# Altium schematic sheet power_management.SchDoc
size Letter; SheetNumber: 5; SheetTotal: 8
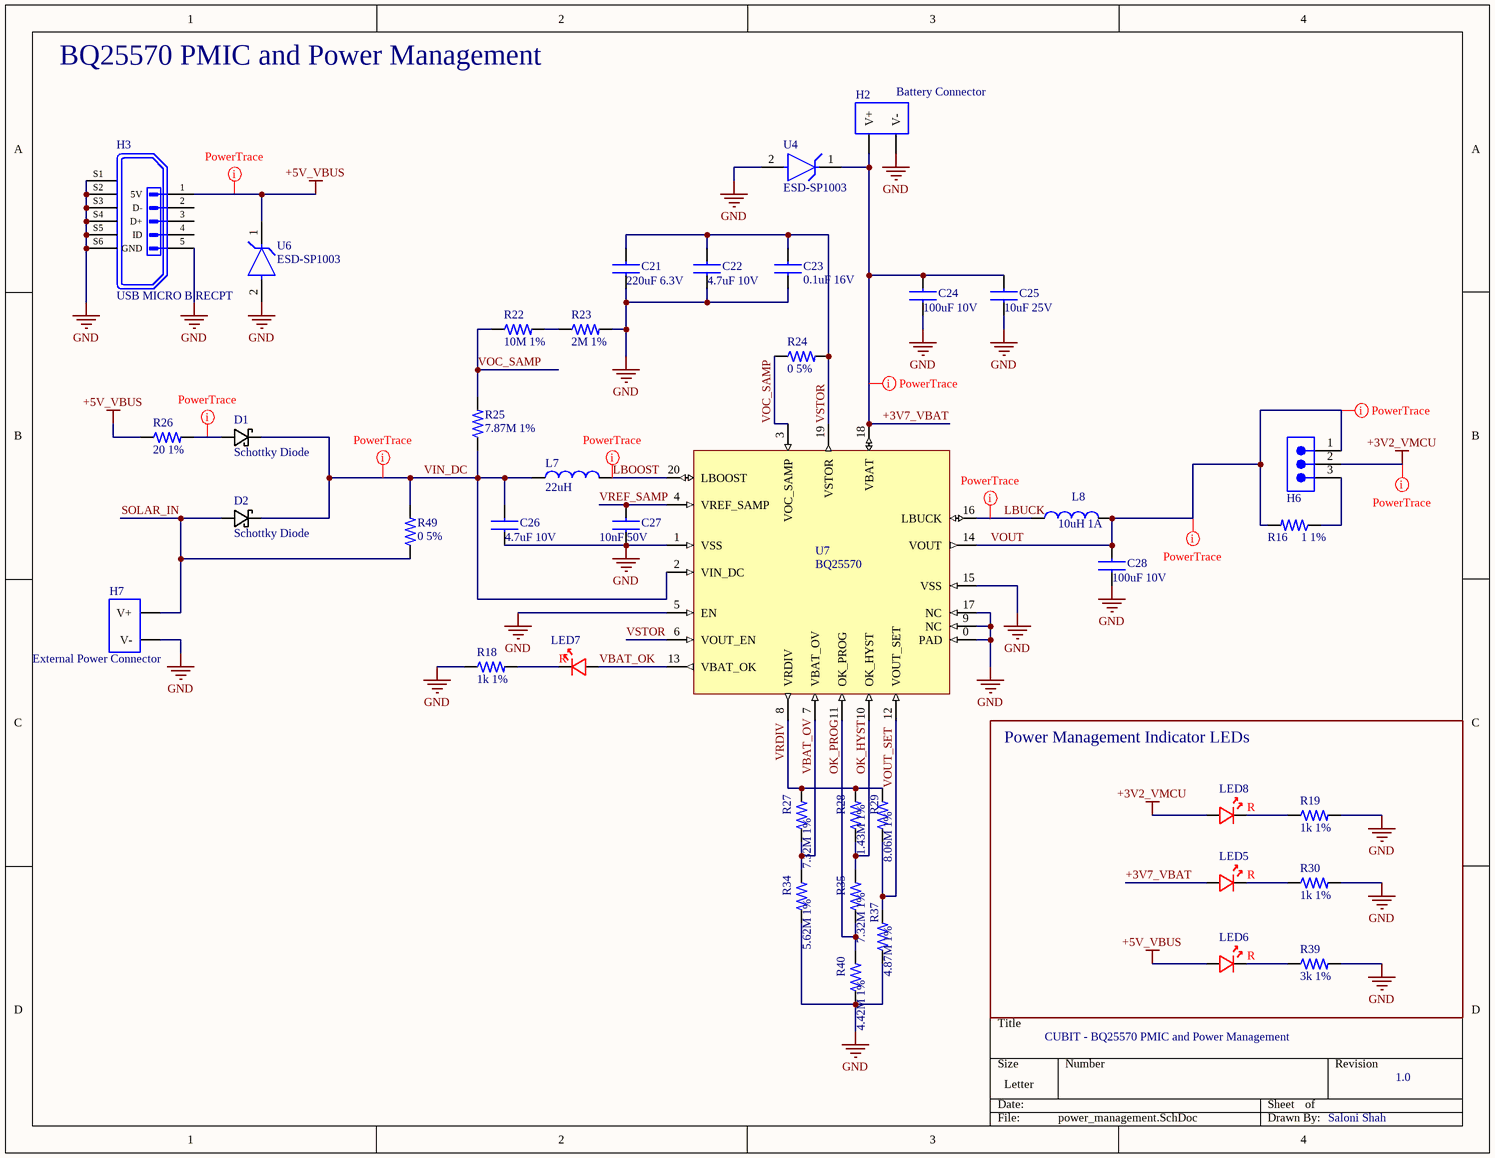
[diagram p0: power_management.SchDoc]

## Parts
C21  220uF 6.3V  [Chip_1210_3.2x2.5]
C22  4.7uF 10V  [CAP_0603_1MM]
C23  0.1uF 16V  [CAP_0603_1MM]
C24  100uF 10V  [Chip_1210_3.2x2.5]
C25  10uF 25V  [CAP_0805_02X125]
C26  4.7uF 10V  [CAP_0603_1MM]
C27  10nF 50V  [CAP_0805_02X125]
C28  100uF 10V  [Chip_1210_3.2x2.5]
D1  Schottky Diode  [SCHOTTKY4336X33N]
D2  Schottky Diode  [SCHOTTKY4336X33N]
H2  Battery Connector  [BAT_CONN]
H3  USB MICRO B RECPT  [MICROUSB_AMPHENOL_10118194-0001LF]
H6  PREC003SAAN-RC  [3_PIN_100mil]  (value not drawn)
H7  External Power Connector  [2_PIN_100mil]
L7  22uH  [2_IND_3x3]
L8  10uH 1A  [2_chip_2.5x2]
LED5  150060RS75000  [LED_0603_RED_WL-SMCW]  (value not drawn)
LED6  150060RS75000  [LED_0603_RED_WL-SMCW]  (value not drawn)
LED7  150060RS75000  [LED_0603_RED_WL-SMCW]  (value not drawn)
LED8  150060RS75000  [LED_0603_RED_WL-SMCW]  (value not drawn)
R16  1 1%  [CAP_0603_1MM]
R18  1k 1%  [2_Chip_0603_RMCF]
R19  1k 1%  [2_Chip_0603_RMCF]
R22  10M 1%  [2_Chip_0603_RMCF]
R23  2M 1%  [2_Chip_0603_RMCF]
R24  0 5%  [CAP_0402_1mm]
R25  7.87M 1%  [2_Chip_0603_RMCF]
R26  20 1%  [2_Chip_0603_RMCF]
R27  7.32M 1%  [2_Chip_0603_RMCF]
R28  1.43M 1%  [2_Chip_0603_RMCF]
R29  8.06M 1%  [2_Chip_0603_RMCF]
R30  1k 1%  [2_Chip_0603_RMCF]
R34  5.62M 1%  [2_Chip_0603_RMCF]
R35  7.32M 1%  [2_Chip_0603_RMCF]
R37  4.87M 1%  [2_Chip_0603_RMCF]
R39  3k 1%  [CAP_0603_1MM]
R40  4.42M 1%  [2_Chip_0603_RMCF]
R49  0 5%  [CAP_0402_1mm]
U4  ESD-SP1003  [Littelfuse_Inc_SP1003_MFG]
U6  ESD-SP1003  [Littelfuse_Inc_SP1003_MFG]
U7  BQ25570  [21_QFN_35x35]

## Blocks framed on the sheet
Power Management Indicator LEDs: LED5 LED6 LED8 R19 R30 R39

## Nets
+3V2_VMCU: H6.2 LED8.A
+5V_VBUS: H3.1(5V) LED6.A R26.1 U6.1(C)
GND: C21.2 C22.2 C23.2 C24.2 C25.2 C26.2 C27.2 C28.2 H2.V- H3.5(GND) H3.S1 H3.S2 H3.S3 H3.S4 H3.S5 H3.S6 H7.2(V-) R18.1 R19.2 R23.2 R30.2 R34.1 R37.1 R39.2 R40.1 U4.2(A) U6.2(A) U7.0(PAD) U7.1(VSS) U7.5(EN) U7.9(NC) U7.15(VSS) U7.17(NC)
+3V7_VBAT: C24.1 C25.1 H2.V+ LED5.A U4.1(C) U7.18(VBAT)
LBOOST: L7.2 U7.20(LBOOST)
LBUCK: L8.1 U7.16(LBUCK)
OK_HYST: R28.1 R35.2 U7.10(OK_HYST)
OK_PROG: R35.1 R40.2 U7.11(OK_PROG)
SOLAR_IN: D2.A H7.1(V+) R49.1
VBAT_OK: LED7.A U7.13(VBAT_OK)
VBAT_OV: R27.1 R34.2 U7.7(VBAT_OV)
VIN_DC: C26.1 D1.C D2.C L7.1 R25.1 R49.2 U7.2(VIN_DC)
VOC_SAMP: R22.1 R24.1 R25.2 U7.3(VOC_SAMP)
VOUT: C28.1 H6.1 L8.2 R16.2 U7.14(VOUT)
VOUT_SET: R29.1 R37.2 U7.12(VOUT_SET)
VRDIV: R27.2 R28.2 R29.2 U7.8(VRDIV)
VREF_SAMP: C27.1 U7.4(VREF_SAMP)
VSTOR: C21.1 C22.1 C23.1 R24.2 U7.6(VOUT_EN) U7.19(VSTOR)
NetD1_A: D1.A R26.2
NetH6_3: H6.3 R16.1
NetLED5_C: LED5.C R30.1
NetLED6_C: LED6.C R39.1
NetLED7_C: LED7.C R18.2
NetLED8_C: LED8.C R19.1
NetR22_2: R22.2 R23.1

Not connected (* = marked no-connect by the designer): H3 2(D-) 3(D+) 4(ID)

## Layout directives
rule Width Constraint [Pref Width = 20mil    Min Width = 6mil    Max Width = 100mil]: +3V2_VMCU, +3V7_VBAT, +5V_VBUS, LBOOST, LBUCK, NetD1_A, VIN_DC, VOUT

## Notes on the sheet
- BQ25570 PMIC and Power Management
- CUBIT - BQ25570 PMIC and Power Management
- 1.0
- Saloni Shah
- (in symbol 150060RS75000) R

## Library data of the parts
C21 = GRM32ER60J227ME05L: Cap 220uF 6.3volts X5R 20%; Manufacturer: Murata; Supplier 1: Digi-Key; Manufacturer Part Number: GRM32ER60J227ME05L; RoHS: Yes; Category: Ceramic Capacitors; Stock 1: 877; Pricing 1: 1=1.62000, 10=1.27900, 50=1.10820, 100=0.95910, 500=0.72462 (USD); Voltage Rating (DC): 6.3V; Dielectric: X5R; Tolerance: 20%; Capacitance: 220uF; Length: 3.2mm; Width: 2.5mm; Thickness: 2.5mm; RoHS Compliant: Yes; ComponentLink1URL: http://www.farnell.com/datasheets/2867883.pdf?src-supplier=Farnell; ComponentLink1Description: http://www.farnell.com/datasheets/2867883.pdf?src-supplier=Farnell; ComponentLink2URL: http://www.farnell.com/datasheets/2867883.pdf?src-supplier=Newark; ComponentLink2Description: http://www.farnell.com/datasheets/2867883.pdf?src-supplier=Newark; ComponentLink3URL: http://search.murata.co.jp/Ceramy/image/img/A01X/G101/ENG/GRM32ER60J227ME05-01.pdf?src-supplier=Digi-Key; ComponentLink3Description: http://search.murata.co.jp/Ceramy/image/img/A01X/G101/ENG/GRM32ER60J227ME05-01.pdf?src-supplier=Digi-Key; ComponentLink4URL: https://search.murata.co.jp/Ceramy/image/img/A01X/G101/ENG/GRM32ER60J227ME05-01.pdf?src-supplier=Digi-Key; ComponentLink4Description: https://search.murata.co.jp/Ceramy/image/img/A01X/G101/ENG/GRM32ER60J227ME05-01.pdf?src-supplier=Digi-Key
C22 C26 = CL10A475KP8NNNC: Cap CL10 Series 4.7 uF 10 V ±10 % Tolerance X5R SMT Multilayer Ceramic Capacitor; Manufacturer: Samsung; Tolerance: 10%; Supplier 1: Digi-Key; Manufacturer Part Number: CL10A475KP8NNNC; RoHS: Yes; Category: Ceramic Capacitors; Stock 1: 5517923; Pricing 1: 1=0.10000, 10=0.04700, 50=0.02580, 100=0.02110, 500=0.01506, 1000=0.01183 (USD); Mount: Surface Mount; Case/Package: 0603; Case Code (Metric): 1608; Case Code (Imperial): 0603; Contact Plating: Tin; Min Operating Temperature: -55°C; Max Operating Temperature: 85°C; Capacitance: 4.7uF; Dielectric: X5R; Package Quantity: 1; Packaging: Tape and Reel; Voltage Rating: 10V; Series: CL; Construction: Flat; Length: 1.6mm; Width: 0.031inch; Height: 0.8mm; Thickness: 0.035inch; Depth: 0.8mm; Radiation Hardening: No; RoHS Compliant: Yes; ComponentLink1URL: https://datasheet.ciiva.com/25797/cl10a475kp8nnnc-25797520.pdf?src-supplier=Digi-Key; ComponentLink1Description: https://datasheet.ciiva.com/25797/cl10a475kp8nnnc-25797520.pdf?src-supplier=Digi-Key; ComponentLink2URL: https://datasheet.ciiva.com/26838/getdatasheetpartid-358676-26838384.pdf?src-supplier=Verical; ComponentLink2Description: https://datasheet.ciiva.com/26838/getdatasheetpartid-358676-26838384.pdf?src-supplier=Verical; ComponentLink3URL: https://datasheet.ciiva.com/16318/cl05b104kq5nnnc-16318245.pdf?src-supplier=Future+Electronics; ComponentLink3Description: https://datasheet.ciiva.com/16318/cl05b104kq5nnnc-16318245.pdf?src-supplier=Future+Electronics
C23 = C0805C104K4RACAUTO: Cap Ceramic 0.1uF 16V X7R 10% SMD 0805 125°C Paper T/R; Manufacturer: KEMET; Capacitance: 100nF; Supplier 1: Digi-Key; Manufacturer Part Number: C0805C104K4RACAUTO; RoHS: Yes; Category: Ceramic Capacitors; Stock 1: 15900; Pricing 1: 1=0.24000, 10=0.16200, 50=0.09700, 100=0.08190, 500=0.05606, 1000=0.04959 (USD); Case/Package: 0805; Min Operating Temperature: -55°C; Max Operating Temperature: 125°C; Tolerance: 10%; Packaging: Tape and Reel; Dielectric: X7R; Length: 2mm; Depth: 1.25mm; RoHS Compliant: Yes; ComponentLink1URL: http://components.arrow.com/part/dataview/0323_00325188?src-supplier=Arrow+Europe; ComponentLink1Description: http://components.arrow.com/part/dataview/0323_00325188?src-supplier=Arrow+Europe
C24 C28 = CL32A107MPVNNNE: Cap 100uF ±20% 10V X5R 1210; Manufacturer: Samsung; Material: Ceramic; Supplier 1: Digi-Key; Manufacturer Part Number: CL32A107MPVNNNE; RoHS: Yes; Category: Ceramic Capacitors; Stock 1: 174637; Pricing 1: 1=1.14000, 10=0.86800, 50=0.72080, 100=0.62070, 500=0.48056 (USD); Mount: Surface Mount; Case/Package: 1210; Case Code (Metric): 3225; Case Code (Imperial): 1210; Contact Plating: Tin; Min Operating Temperature: -55°C; Max Operating Temperature: 85°C; Tolerance: 20%; Capacitance: 100uF; Voltage Rating: 10V; Packaging: Tape and Reel; Dielectric: X5R; Voltage: 10V; Voltage Rating (DC): 10V; Length: 3.2mm; Width: 0.098inch; Height: 2.5mm; Thickness: 0.11inch; Depth: 2.5mm; Radiation Hardening: No; Lead Free: Lead Free; RoHS Compliant: Yes; ComponentLink1URL: https://datasheet.ciiva.com/26947/getdatasheetpartid-468228-26947022.pdf?src-supplier=Verical; ComponentLink1Description: https://datasheet.ciiva.com/26947/getdatasheetpartid-468228-26947022.pdf?src-supplier=Verical
C25 = GRM21BR61E106KA73K: Cap 0805 25 V 10 uF ±20% Tolerance X5R Monolithic Ceramic Chip Capacitor; Manufacturer: Murata; Tolerance: 10%; Supplier 1: Digi-Key; Manufacturer Part Number: GRM21BR61E106KA73K; RoHS: Yes; Category: Ceramic Capacitors; Stock 1: 1875; Pricing 1: 1=0.23000, 10=0.15700, 50=0.09400, 100=0.07940, 500=0.05434, 1000=0.04807, 2500=0.04598, 5000=0.04180 (USD); Mount: Surface Mount; Case/Package: 0805; Weight: 0.000335oz; Min Operating Temperature: -55°C; Max Operating Temperature: 85°C; Packaging: Tape and Reel; Capacitance: 10uF; Voltage Rating: 25V; Package Quantity: 10000; Dielectric: X5R; Voltage Rating (DC): 25V; Length: 0.079inch; Width: 0.049inch; Thickness: 0.055inch; RoHS Compliant: Yes; ComponentLink1URL: http://www.mouser.com/ds/2/281/c02e-2905.pdf?src-supplier=Mouser; ComponentLink1Description: http://www.mouser.com/ds/2/281/c02e-2905.pdf?src-supplier=Mouser; ComponentLink2URL: http://search.murata.co.jp/Ceramy/image/img/A01X/G101/ENG/GRM21BR61E106KA73-01.pdf?src-supplier=Digi-Key; ComponentLink2Description: http://search.murata.co.jp/Ceramy/image/img/A01X/G101/ENG/GRM21BR61E106KA73-01.pdf?src-supplier=Digi-Key; ComponentLink3URL: https://search.murata.co.jp/Ceramy/image/img/A01X/G101/ENG/GRM21BR61E106KA73-01.pdf?src-supplier=Digi-Key; ComponentLink3Description: https://search.murata.co.jp/Ceramy/image/img/A01X/G101/ENG/GRM21BR61E106KA73-01.pdf?src-supplier=Digi-Key
C27 = CL21B103KBCNNNC: Cap 10nF ±10% 50V X7R 0805; Manufacturer: Samsung; Supplier 1: Digi-Key; Manufacturer Part Number: CL21B103KBCNNNC; RoHS: Yes; Category: Ceramic Capacitors; Stock 1: 358475; Pricing 1: 1=0.10000, 10=0.05000, 50=0.02700, 100=0.02210, 500=0.01578, 1000=0.01240 (USD); Mount: Surface Mount; Case/Package: 0805; Case Code (Metric): 2012; Case Code (Imperial): 0805; Contact Plating: Tin; Min Operating Temperature: -55°C; Max Operating Temperature: 125°C; Packaging: Tape and Reel; Series: CL; Voltage Rating: 50V; Capacitance: 10nF; Tolerance: 10%; Dielectric: X7R; Voltage Rating (DC): 50V; Construction: Flat; Length: 2mm; Width: 0.049inch; Height: 0.85mm; Thickness: 0.037inch; Depth: 1.25mm; Radiation Hardening: No; RoHS Compliant: Yes; Lead Free: Lead Free; ComponentLink1URL: https://datasheet.ciiva.com/26920/getdatasheetpartid-640087-26920198.pdf?src-supplier=Verical; ComponentLink1Description: https://datasheet.ciiva.com/26920/getdatasheetpartid-640087-26920198.pdf?src-supplier=Verical; ComponentLink2URL: https://datasheet.ciiva.com/26787/cl21b103kbcnnnc-26787008.pdf?src-supplier=IIIC; ComponentLink2Description: https://datasheet.ciiva.com/26787/cl21b103kbcnnnc-26787008.pdf?src-supplier=IIIC
D1 D2 = LSM115JE3/TR13: LSM115J Series 15 V 1 A Surface Mount Schottky Rectifier - DO-214BA; Manufacturer: Microchip; Supplier 1: Digi-Key; Manufacturer Part Number: LSM115JE3/TR13; RoHS: Yes; Stock 1: 16365; Pricing 1: 1=0.51000 (USD)
H2 = 0554600272: 2.00mm Pitch Mi ll System Wire-to-Board Header, Surface Mount, Single Row, Vertical, 2 Circuits; Manufacturer: Molex; Number of Positions: 2; Connector Type: Male Pin; Max Voltage Rating (AC): 125V; Pitch: 0.079inch; Supplier 1: Digi-Key; Manufacturer Part Number: 0554600272; RoHS: Yes; Category: Headers and Wire Housings; Stock 1: 5247; Pricing 1: 1=1.33000, 10=1.10500, 100=0.92040 (USD); Mount: Surface Mount; Housing Material: Polyamide; Contact Plating: Tin,Copper; Contact Material: Bronze; Color: Natural; Housing Color: Natural; Min Operating Temperature: -40°C; Max Operating Temperature: 105°C; Number of Rows: 1; Packaging: Tape and Reel; Termination: Solder; Orientation: Straight; Length: 8.1mm; Depth: 7mm; RoHS Compliant: Yes; ComponentLink1URL: https://datasheet.ciiva.com/18487/554600272-sd-18487017.pdf?src-supplier=Digi-Key; ComponentLink1Description: https://datasheet.ciiva.com/18487/554600272-sd-18487017.pdf?src-supplier=Digi-Key; ComponentLink2URL: https://datasheet.ciiva.com/18487/554600272-sd-18487018.pdf?src-supplier=Digi-Key; ComponentLink2Description: https://datasheet.ciiva.com/18487/554600272-sd-18487018.pdf?src-supplier=Digi-Key; ComponentLink3URL: https://datasheet.ciiva.com/18487/554600272-sd-18487019.pdf?src-supplier=Digi-Key; ComponentLink3Description: https://datasheet.ciiva.com/18487/554600272-sd-18487019.pdf?src-supplier=Digi-Key
H3 = 10118194-0001LF: USB - micro B USB 2.0 Receptacle Connector 5 Position Surface Mount, Right Angle; Through Hole; Manufacturer: Amphenol FCI; Number of Terminals/Pins: 5; Current Rating: 1.8A; Connector Type: USB,Receptacle; Insulation Resistance: 1GR; Number of Ports: 1; Max Voltage Rating (AC): 100V; Pitch: 0.65mm; Supplier 1: Digi-Key; Manufacturer Part Number: 10118194-0001LF; RoHS: Yes; Category: USB Connectors; Stock 1: 87961; Pricing 1: 1=0.48000, 10=0.45100, 25=0.38680, 50=0.32860, 100=0.31580, 250=0.28360, 500=0.27070 (USD); Mount: Surface Mount,Horizontal; Contact Material: Copper Alloy; Contact Plating: Gold; Housing Material: Polymer; Color: Black; Min Operating Temperature: -55°C; Max Operating Temperature: 85°C; Package Quantity: 9600; Packaging: Tape and Reel; Gender: Receptacle; Number of Contacts: 5; Termination: Solder; Orientation: Right Angle; Features: Shielded; Length: 8.05mm; Depth: 5mm; Radiation Hardening: No; Lead Free: Lead Free; Flammability Rating: UL94 V-0; ComponentLink1URL: https://datasheet.ciiva.com/4598/10118194ac-197217-4598807.pdf?src-supplier=Mouser; ComponentLink1Description: https://datasheet.ciiva.com/4598/10118194ac-197217-4598807.pdf?src-supplier=Mouser; ComponentLink2URL: https://datasheet.ciiva.com/26945/getdatasheetpartid-418619-26945695.pdf?src-supplier=Verical; ComponentLink2Description: https://datasheet.ciiva.com/26945/getdatasheetpartid-418619-26945695.pdf?src-supplier=Verical; ComponentLink3URL: https://datasheet.ciiva.com/851/10118194-851110.pdf?src-supplier=Digi-Key; ComponentLink3Description: https://datasheet.ciiva.com/851/10118194-851110.pdf?src-supplier=Digi-Key; ComponentLink4URL: https://datasheet.ciiva.com/851/10118194-851111.pdf?src-supplier=Digi-Key; ComponentLink4Description: https://datasheet.ciiva.com/851/10118194-851111.pdf?src-supplier=Digi-Key; Supplier Part Number 1: 609-4618-6-ND
H6 = SW_3Pin_100mil_Switch: Connector Header Through Hole 3 position 0.100" (2.54mm); Value: CONN HEADER VERT 3POS 2.54MM; Digikey Link: https://www.digikey.com/product-detail/en/PREC003SAAN-RC/S1012EC-03-ND/2774851/?itemSeq=304982371; Digikey Part: S1012EC-03-ND; Type: Extended; LCSC Part#: C429954
H7 = ext_pwr_conn
L7 = VLS3015CX-220M-1: Inductor Power Shielded Wirewound 22uH 20% 1MHz Ferrite 0.87A 0.496Ohm DCR 1212 T/R; Manufacturer: TDK; Supplier 1: Digi-Key; Manufacturer Part Number: VLS3015CX-220M-1; RoHS: Yes; Category: Fixed Inductors; Stock 1: 1791; Pricing 1: 1=0.40000, 10=0.35400, 25=0.30960, 50=0.26540, 100=0.24320, 250=0.22112, 500=0.20784, 1000=0.15919 (USD); RoHS Compliant: Yes
L8 = 1239AS-H-100M=P2: Inductor Power Shielded Multi-Layer 10uH 20% 1MHz Metal 0.85A 0.46Ohm DCR 1008 T/R; Manufacturer: Murata; Core Material: Ferrite,Metal; DC Resistance (DCR): 460mR; Max DC Current: 850mA; Supplier 1: Digi-Key; Manufacturer Part Number: 1239AS-H-100M=P2; RoHS: Yes; Category: Fixed Inductors; Stock 1: 142733; Pricing 1: 1=0.39000, 10=0.34400, 25=0.30120, 50=0.25840, 100=0.23680, 250=0.21524, 500=0.20234, 1000=0.15498 (USD); Mount: Surface Mount; Case/Package: 1008; Case Code (Metric): 2520; Case Code (Imperial): 1008; Min Operating Temperature: -40°C; Max Operating Temperature: 85°C; Packaging: Tape and Reel; Resistor Type: Wirewound; Inductance: 10uH; Current Rating: 1A; Shielding: Shielded; Test Frequency: 1MHz; Tolerance: 20%; Length: 0.098inch; Width: 0.079inch; Height - Seated (Max): 0.047inch; Depth: 2mm; RoHS Compliant: Yes; ComponentLink1URL: http://www.farnell.com/datasheets/2339712.pdf?src-supplier=Farnell; ComponentLink1Description: http://www.farnell.com/datasheets/2339712.pdf?src-supplier=Farnell; ComponentLink2URL: http://www.toko.co.jp/products/pdf/inductors/dfe252012c.pdf?src-supplier=Avnet; ComponentLink2Description: http://www.toko.co.jp/products/pdf/inductors/dfe252012c.pdf?src-supplier=Avnet; ComponentLink3URL: http://www.farnell.com/datasheets/2339712.pdf?src-supplier=Newark; ComponentLink3Description: http://www.farnell.com/datasheets/2339712.pdf?src-supplier=Newark; ComponentLink4URL: https://www.murata.com/~/media/webrenewal/products/inductor/chip/tokoproducts/wirewoundmetalalloychiptype/m_dfe252012c.ashx?src-supplier=Digi-Key; ComponentLink4Description: https://www.murata.com/~/media/webrenewal/products/inductor/chip/tokoproducts/wirewoundmetalalloychiptype/m_dfe252012c.ashx?src-supplier=Digi-Key
LED5-LED8 = 150060RS75000: LED Low-Power Uni-Color Red 630nm 2V 2-Pin Chip 0603(1608Metric) T/R; Manufacturer: Wurth Electronics; Viewing Angle: 140°; Lens Style: Clear,Rectangular; Luminous Intensity: 250mcd; Forward Current: 30mA; Wavelength: 625nm; Test Current: 20mA; Supplier 1: Digi-Key; Manufacturer Part Number: 150060RS75000; RoHS: Yes; Category: LEDs; Stock 1: 39; Pricing 1: 1=0.15000, 50=0.13800, 100=0.11800, 500=0.10200, 1000=0.09900 (USD); Mount: Surface Mount; Case/Package: 0603; Color: Red; Case Code (Metric): 1608; Case Code (Imperial): 0603; Min Operating Temperature: -40°C; Max Operating Temperature: 85°C; Package Quantity: 1; Packaging: Cut Tape; Forward Voltage: 2V; Dominant Wavelength: 625nm; Length: 1.6mm; Width: 0.8mm; Height: 0.7mm; REACH SVHC: Unknown; RoHS Compliant: Yes; ComponentLink1URL: https://datasheet.ciiva.com/29563/150060rs75000-29563040.pdf?src-supplier=Digi-Key; ComponentLink1Description: https://datasheet.ciiva.com/29563/150060rs75000-29563040.pdf?src-supplier=Digi-Key; ComponentLink2URL: https://datasheet.ciiva.com/29279/759428-da-01-en-chipled-0603-w-kl-rot-150060rs75000-29279196.pdf?src-supplier=Conrad; ComponentLink2Description: https://datasheet.ciiva.com/29279/759428-da-01-en-chipled-0603-w-kl-rot-150060rs75000-29279196.pdf?src-supplier=Conrad
R16 = RC0603FR-101RL: Res 1 Ohm 1% 1/10W ±200ppm/°C Molded SMD SMD Paper T/R; Manufacturer: Yageo; Resistance: 1R; Power Rating: 100mW; Voltage Rating: 50V; Supplier 1: Digi-Key; Manufacturer Part Number: RC0603FR-101RL; Category: Chip SMD Resistors; Stock 1: 19075; Pricing 1: 1=0.10000, 10=0.04800, 100=0.01940, 1000=0.00872, 2500=0.00756, 5000=0.00625 (USD); Case/Package: 0603; Case Code (Imperial): 0603; Case Code (Metric): 1608; Contact Plating: Tin; Min Operating Temperature: -55°C; Max Operating Temperature: 155°C; Tolerance: 1%; Packaging: Tape and Reel; Resistor Type: Thick Film; Termination: SMD/SMT; Temperature Coefficient: 200ppm/°C; Series: RC; Construction: Rectangular; Length: 1.6mm; Width: 0.8mm; Height: 0.45mm; Depth: 0.8mm; Radiation Hardening: No; Military Standard: Not; RoHS Compliant: Yes; ComponentLink1URL: http://www.mouser.com/ds/2/447/RC0603-272842.pdf?src-supplier=Mouser; ComponentLink1Description: http://www.mouser.com/ds/2/447/RC0603-272842.pdf?src-supplier=Mouser; ComponentLink2URL: http://components.arrow.com/part/dataview/0323_03914755?src-supplier=Arrow+Europe; ComponentLink2Description: http://components.arrow.com/part/dataview/0323_03914755?src-supplier=Arrow+Europe; ComponentLink3URL: http://www.yageo.com/documents/recent/PYu-RC_Group_51_RoHS_L_2.pdf?src-supplier=Avnet; ComponentLink3Description: http://www.yageo.com/documents/recent/PYu-RC_Group_51_RoHS_L_2.pdf?src-supplier=Avnet; ComponentLink4URL: http://www.yageo.com/documents/recent/PYu-RC0603_51_RoHS_L_5.pdf?src-supplier=Avnet+Europe; ComponentLink4Description: http://www.yageo.com/documents/recent/PYu-RC0603_51_RoHS_L_5.pdf?src-supplier=Avnet+Europe; ComponentLink5URL: https://datasheet.octopart.com/RC0603FR-101RL-Yageo-datasheet-8328172.pdf?src-supplier=_legacy+Avnet; ComponentLink5Description: https://datasheet.octopart.com/RC0603FR-101RL-Yageo-datasheet-8328172.pdf?src-supplier=_legacy+Avnet; ComponentLink6URL: https://datasheet.octopart.com/RC0603FR-101RL-Yageo-datasheet-73766026.pdf; ComponentLink6Description: https://datasheet.octopart.com/RC0603FR-101RL-Yageo-datasheet-73766026.pdf
R18 R19 R30 = RMCF0603FT1K00: Res 1K Ohm 1% 0.1W(1/10W) ±100ppm/C Pad SMD Automotive T/R; Manufacturer: Stackpole Electronics; Resistance: 1kR; Power Rating: 100mW; Temperature Coefficient: 100ppm/°C; Supplier 1: Digi-Key; Manufacturer Part Number: RMCF0603FT1K00; RoHS: Yes; Category: Chip SMD Resistors; Pricing 1: 1=0.10000, 10=0.01700, 100=0.00680, 1000=0.00305, 2500=0.00264 (USD); Mount: Surface Mount; Case/Package: 0603; Case Code (Metric): 1608; Case Code (Imperial): 0603; Contact Plating: Tin,Matte; Size Code: 0603; Min Operating Temperature: -55°C; Max Operating Temperature: 155°C; Tolerance: 1%; Packaging: Tape and Reel; Resistor Type: Thick Film; Number of Terminations: 2; Max Power Dissipation: 100mW; Features: Automotive AEC-Q200; Series: RMCF; Construction: Rectangular; Length: 1.55mm; Width: 0.031inch; Height: 0.022inch; Depth: 0.8mm; Radiation Hardening: No; Military Standard: Not; Lead Free: Lead Free; RoHS Compliant: Yes; ComponentLink1URL: https://www.seielect.com/catalog/sei-rmcf_rmcp.pdf?src-supplier=Digi-Key; ComponentLink1Description: https://www.seielect.com/catalog/sei-rmcf_rmcp.pdf?src-supplier=Digi-Key; ComponentLink2URL: https://www.seielect.com/catalog/SEI-RMCF_RMCP.pdf?src-supplier=Avnet; ComponentLink2Description: https://www.seielect.com/catalog/SEI-RMCF_RMCP.pdf?src-supplier=Avnet; ComponentLink3URL: https://www.seielect.com/catalog/SEI-Packaging.pdf?src-supplier=Avnet; ComponentLink3Description: https://www.seielect.com/catalog/SEI-Packaging.pdf?src-supplier=Avnet; ComponentLink4URL: https://www.seielect.com/catalog/SEI-Packaging.pdf?src-supplier=Arrow+Electronics; ComponentLink4Description: https://www.seielect.com/catalog/SEI-Packaging.pdf?src-supplier=Arrow+Electronics; ComponentLink5URL: https://www.seielect.com/catalog/SEI-RMCF_RMCP.pdf?src-supplier=Avnet+Asia; ComponentLink5Description: https://www.seielect.com/catalog/SEI-RMCF_RMCP.pdf?src-supplier=Avnet+Asia; ComponentLink6URL: http://www.seielect.com/Catalog/SEI-rmc.pdf?src-supplier=Future+Electronics; ComponentLink6Description: http://www.seielect.com/Catalog/SEI-rmc.pdf?src-supplier=Future+Electronics; ComponentLink7URL: https://www.seielect.com/catalog/SEI-Packaging.pdf?src-supplier=Verical; ComponentLink7Description: https://www.seielect.com/catalog/SEI-Packaging.pdf?src-supplier=Verical; ComponentLink8URL: https://www.seielect.com/catalog/SEI-Packaging.pdf?src-supplier=Quest; ComponentLink8Description: https://www.seielect.com/catalog/SEI-Packaging.pdf?src-supplier=Quest
R22 = RMCF0603FT10M0: Res 10M Ohm 1% 1/10W ±200ppm/°C Molded SMD SMD Paper T/R; Manufacturer: Stackpole Electronics; Resistance: 10MR; Max Power Dissipation: 100mW; Supplier 1: Digi-Key; Manufacturer Part Number: RMCF0603FT10M0; RoHS: Yes; Category: Chip SMD Resistors; Stock 1: 127846; Pricing 1: 1=0.10000, 10=0.02500, 100=0.01020, 1000=0.00457, 2500=0.00397 (USD); Mount: Surface Mount; Case/Package: 0603; Case Code (Metric): 1608; Case Code (Imperial): 0603; Contact Plating: Tin,Matte; Min Operating Temperature: -55°C; Max Operating Temperature: 155°C; Tolerance: 1%; Packaging: Tape and Reel; Resistor Type: Thick Film; Number of Terminations: 2; Temperature Coefficient: 200ppm/°C; Features: Automotive AEC-Q200; Series: RMCF; Construction: Rectangular; Length: 0.061inch; Width: 0.031inch; Height: 0.022inch; Depth: 0.8mm; Radiation Hardening: No; Military Standard: Not; Lead Free: Lead Free; RoHS Compliant: Yes; ComponentLink1URL: http://components.arrow.com/part/dataview/47093497S7925112N1174?src-supplier=Arrow+Electronics; ComponentLink1Description: http://components.arrow.com/part/dataview/47093497S7925112N1174?src-supplier=Arrow+Electronics; ComponentLink2URL: https://www.seielect.com/catalog/SEI-RMCF_RMCP.pdf?src-supplier=Avnet; ComponentLink2Description: https://www.seielect.com/catalog/SEI-RMCF_RMCP.pdf?src-supplier=Avnet; ComponentLink3URL: https://www.verical.com/server-webapp/html/getDatasheet?partID=691637&src-supplier=Verical; ComponentLink3Description: https://www.verical.com/server-webapp/html/getDatasheet?partID=691637&src-supplier=Verical; ComponentLink4URL: https://www.seielect.com/catalog/SEI-Packaging.pdf?src-supplier=Digi-Key; ComponentLink4Description: https://www.seielect.com/catalog/SEI-Packaging.pdf?src-supplier=Digi-Key
R23 = RMCF0603FT2M00: RES 2M OHM 1% 1/10W 0603; Manufacturer: Stackpole Electronics; Resistance: 2MR; Max Power Dissipation: 100mW; Temperature Coefficient: 200ppm/°C; Supplier 1: Digi-Key; Manufacturer Part Number: RMCF0603FT2M00; RoHS: Yes; Category: Chip SMD Resistors; Stock 1: 2082; Pricing 1: 1=0.10000, 10=0.02500, 100=0.01020, 1000=0.00457, 2500=0.00397 (USD); Mount: Surface Mount; Case/Package: 0603; Case Code (Metric): 1608; Case Code (Imperial): 0603; Contact Plating: Tin,Matte; Min Operating Temperature: -55°C; Max Operating Temperature: 155°C; Packaging: Tape and Reel; Tolerance: 1%; Resistor Type: Thick Film; Number of Terminations: 2; Features: Automotive AEC-Q200; Series: RMCF; Construction: Rectangular; Length: 0.061inch; Width: 0.031inch; Height: 0.022inch; Depth: 0.8mm; Radiation Hardening: No; Military Standard: Not; RoHS Compliant: Yes; ComponentLink1URL: https://datasheet.ciiva.com/26875/getdatasheetpartid-719436-26875364.pdf?src-supplier=Verical; ComponentLink1Description: https://datasheet.ciiva.com/26875/getdatasheetpartid-719436-26875364.pdf?src-supplier=Verical
R24 R49 = RC1005J000CS: Res 0 Ohms ±5% 0.063 W 0402 Thick Film Surface Mount Chip Resistor; Manufacturer: Samsung; Resistance: 0R; Power Rating: 63mW; Temperature Coefficient: 200ppm/°C; Voltage Rating (DC): 50V; Supplier 1: Digi-Key; Manufacturer Part Number: RC1005J000CS; RoHS: Yes; Category: Chip SMD Resistors; Stock 1: 580; Pricing 1: 1=0.10000, 10=0.04200, 25=0.03040, 50=0.02300, 100=0.01700, 250=0.01296, 500=0.01036, 1000=0.00763, 5000=0.00547 (USD); Mount: Surface Mount; Case/Package: 0402; Case Code (Metric): 1005; Case Code (Imperial): 0402; Contact Plating: Tin; Size Code: 0402; Min Operating Temperature: -55°C; Max Operating Temperature: 125°C; Packaging: Tape and Reel; Tolerance: 5%; Resistor Type: Thick Film; Number of Terminations: 2; Max Power Dissipation: 63mW; Features: Moisture Resistant; Series: RC; Construction: Rectangular; Length: 1mm; Width: 0.02inch; Height: 0.016inch; Depth: 0.5mm; Radiation Hardening: No; Military Standard: Not; Lead Free: Lead Free; RoHS Compliant: Yes; ComponentLink1URL: https://datasheet.ciiva.com/15196/getdatasheetpartid-499011-15196236.pdf?src-supplier=Verical; ComponentLink1Description: https://datasheet.ciiva.com/15196/getdatasheetpartid-499011-15196236.pdf?src-supplier=Verical; ComponentLink2URL: https://datasheet.ciiva.com/16449/rcseries-16449310.pdf?src-supplier=Future+Electronics; ComponentLink2Description: https://datasheet.ciiva.com/16449/rcseries-16449310.pdf?src-supplier=Future+Electronics
R25 = RMCF0603FT7M87: Res 7.87M Ohm 1% 1/10W ±200ppm/°C Molded SMD SMD Paper T/R; Manufacturer: Stackpole Electronics; Resistance: 7.87MR; Max Power Dissipation: 100mW; Supplier 1: Digi-Key; Manufacturer Part Number: RMCF0603FT7M87; RoHS: Yes; Category: Chip SMD Resistors; Stock 1: 4289; Pricing 1: 1=0.10000, 10=0.02500, 100=0.01020, 1000=0.00457, 2500=0.00397 (USD); Mount: Surface Mount; Case/Package: 0603; Contact Plating: Tin,Matte; Min Operating Temperature: -55°C; Max Operating Temperature: 155°C; Packaging: Tape and Reel; Tolerance: 1%; Resistor Type: Thick Film; Number of Terminations: 2; Temperature Coefficient: 200ppm/°C; Features: Automotive AEC-Q200; Series: RMCF; Length: 0.061inch; Width: 0.031inch; Height: 0.022inch; Radiation Hardening: No; RoHS Compliant: Yes; ComponentLink1URL: https://www.seielect.com/Catalog/SEI-RMCF_RMCP.pdf?src-supplier=Digi-Key; ComponentLink1Description: https://www.seielect.com/Catalog/SEI-RMCF_RMCP.pdf?src-supplier=Digi-Key; ComponentLink2URL: https://www.seielect.com/catalog/SEI-RMCF_RMCP.pdf?src-supplier=Avnet; ComponentLink2Description: https://www.seielect.com/catalog/SEI-RMCF_RMCP.pdf?src-supplier=Avnet
R26 = KTR03EZPF20R0: Res High Voltage 0603 20 Ohm 1/10W 1% SMD; Manufacturer: Rohm; Resistance: 20R; Max Power Dissipation: 100mW; Temperature Coefficient: 100ppm/°C; Supplier 1: Digi-Key; Manufacturer Part Number: KTR03EZPF20R0; RoHS: Yes; Category: Chip SMD Resistors; Stock 1: 3395; Pricing 1: 1=0.17000, 10=0.14800, 100=0.05690, 1000=0.02505, 2500=0.02163 (USD); Case/Package: 0603; Case Code (Metric): 1608; Case Code (Imperial): 0603; Min Operating Temperature: -55°C; Max Operating Temperature: 155°C; Package Quantity: 5000; Packaging: Tape and Reel; Tolerance: 1%; Resistor Type: Thick Film; Number of Terminations: 2; Features: Automotive AEC-Q200; Series: KTR; Length: 0.063inch; Width: 0.031inch; Height: 0.022inch; RoHS Compliant: Yes; ComponentLink1URL: https://datasheet.ciiva.com/14932/ktr-14932075.pdf?src-supplier=Digi-Key; ComponentLink1Description: https://datasheet.ciiva.com/14932/ktr-14932075.pdf?src-supplier=Digi-Key; ComponentLink2URL: https://datasheet.ciiva.com/14925/ktr-14925734.pdf?src-supplier=Digi-Key; ComponentLink2Description: https://datasheet.ciiva.com/14925/ktr-14925734.pdf?src-supplier=Digi-Key
R27 R35 = RMCF0603FT7M32: Res 7.32M Ohm 1% 1/10W ±200ppm/°C Molded SMD SMD Paper T/R; Manufacturer: Stackpole Electronics; Resistance: 7.32MR; Supplier 1: Digi-Key; Manufacturer Part Number: RMCF0603FT7M32; RoHS: Yes; Category: Chip SMD Resistors; Stock 1: 10385; Pricing 1: 1=0.10000, 10=0.02500, 100=0.01020, 1000=0.00457, 2500=0.00397 (USD); Mount: Surface Mount; Case/Package: 0603; Contact Plating: Tin,Matte; Min Operating Temperature: -55°C; Max Operating Temperature: 155°C; Packaging: Tape and Reel; Tolerance: 1%; Resistor Type: Thick Film; Temperature Coefficient: 200ppm/°C; Radiation Hardening: No; RoHS Compliant: Yes; ComponentLink1URL: https://www.seielect.com/catalog/SEI-RMCF_RMCP.pdf?src-supplier=Avnet; ComponentLink1Description: https://www.seielect.com/catalog/SEI-RMCF_RMCP.pdf?src-supplier=Avnet; ComponentLink2URL: https://www.seielect.com/catalog/sei-rmcf_rmcp.pdf?src-supplier=Digi-Key; ComponentLink2Description: https://www.seielect.com/catalog/sei-rmcf_rmcp.pdf?src-supplier=Digi-Key
R28 = RMCF0603FT1M43: Res 1.43M Ohm 1% 1/10W ±200ppm/°C Molded SMD SMD Paper T/R; Manufacturer: Stackpole Electronics; Resistance: 1.43MR; Supplier 1: Digi-Key; Manufacturer Part Number: RMCF0603FT1M43; RoHS: Yes; Category: Chip SMD Resistors; Stock 1: 5908; Pricing 1: 1=0.10000, 10=0.02500, 100=0.01020, 1000=0.00457, 2500=0.00397 (USD); Mount: Surface Mount; Case/Package: 0603; Contact Plating: Tin,Matte; Min Operating Temperature: -55°C; Max Operating Temperature: 155°C; Packaging: Tape and Reel; Tolerance: 1%; Resistor Type: Thick Film; Temperature Coefficient: 200ppm/°C; Radiation Hardening: No; RoHS Compliant: Yes; ComponentLink1URL: http://components.arrow.com/part/dataview/40961582S8179483N1174?src-supplier=Arrow+Electronics; ComponentLink1Description: http://components.arrow.com/part/dataview/40961582S8179483N1174?src-supplier=Arrow+Electronics; ComponentLink2URL: https://www.seielect.com/catalog/sei-rmcf_rmcp.pdf?src-supplier=Digi-Key; ComponentLink2Description: https://www.seielect.com/catalog/sei-rmcf_rmcp.pdf?src-supplier=Digi-Key; ComponentLink3URL: https://www.seielect.com/catalog/SEI-RMCF_RMCP.pdf?src-supplier=Avnet; ComponentLink3Description: https://www.seielect.com/catalog/SEI-RMCF_RMCP.pdf?src-supplier=Avnet
R29 = RMCF0603FT8M06: Res 8.06M Ohm 1% 1/10W ±200ppm/°C Molded SMD SMD Paper T/R; Manufacturer: Stackpole Electronics; Resistance: 8.06MR; Supplier 1: Digi-Key; Manufacturer Part Number: RMCF0603FT8M06; RoHS: Yes; Category: Chip SMD Resistors; Stock 1: 19888; Pricing 1: 1=0.10000, 10=0.02500, 100=0.01020, 1000=0.00457, 2500=0.00397 (USD); Mount: Surface Mount; Case/Package: 0603; Contact Plating: Tin,Matte; Min Operating Temperature: -55°C; Max Operating Temperature: 155°C; Packaging: Tape and Reel; Tolerance: 1%; Resistor Type: Thick Film; Temperature Coefficient: 200ppm/°C; Radiation Hardening: No; RoHS Compliant: Yes; ComponentLink1URL: https://www.seielect.com/catalog/SEI-RMCF_RMCP.pdf?src-supplier=Avnet; ComponentLink1Description: https://www.seielect.com/catalog/SEI-RMCF_RMCP.pdf?src-supplier=Avnet; ComponentLink2URL: https://www.seielect.com/catalog/SEI-Packaging.pdf?src-supplier=Digi-Key; ComponentLink2Description: https://www.seielect.com/catalog/SEI-Packaging.pdf?src-supplier=Digi-Key; ComponentLink3URL: https://www.seielect.com/catalog/sei-rmcf_rmcp.pdf?src-supplier=Digi-Key; ComponentLink3Description: https://www.seielect.com/catalog/sei-rmcf_rmcp.pdf?src-supplier=Digi-Key
R34 = RMCF0603FT5M62: Res 5.62M Ohm 1% 1/10W ±200ppm/°C Molded SMD SMD Paper T/R; Manufacturer: Stackpole Electronics; Resistance: 5.62MR; Supplier 1: Digi-Key; Manufacturer Part Number: RMCF0603FT5M62; RoHS: Yes; Category: Chip SMD Resistors; Stock 1: 10522; Pricing 1: 1=0.10000, 10=0.02500, 100=0.01020, 1000=0.00457, 2500=0.00397 (USD); Mount: Surface Mount; Case/Package: 0603; Contact Plating: Tin,Matte; Min Operating Temperature: -55°C; Max Operating Temperature: 155°C; Packaging: Tape and Reel; Tolerance: 1%; Resistor Type: Thick Film; Temperature Coefficient: 200ppm/°C; Radiation Hardening: No; ComponentLink1URL: https://www.seielect.com/catalog/sei-rmcf_rmcp.pdf?src-supplier=Digi-Key; ComponentLink1Description: https://www.seielect.com/catalog/sei-rmcf_rmcp.pdf?src-supplier=Digi-Key; ComponentLink2URL: https://www.seielect.com/catalog/SEI-RMCF_RMCP.pdf?src-supplier=Avnet; ComponentLink2Description: https://www.seielect.com/catalog/SEI-RMCF_RMCP.pdf?src-supplier=Avnet
R37 = RMCF0603FT4M87: Res 4.87M Ohm 1% 1/10W ±200ppm/°C Molded SMD SMD Paper T/R; Manufacturer: Stackpole Electronics; Resistance: 4.87MR; Supplier 1: Digi-Key; Manufacturer Part Number: RMCF0603FT4M87; RoHS: Yes; Category: Chip SMD Resistors; Stock 1: 5904; Pricing 1: 1=0.10000, 10=0.02500, 100=0.01020, 1000=0.00457, 2500=0.00397 (USD); Mount: Surface Mount; Case/Package: 0603; Contact Plating: Tin,Matte; Min Operating Temperature: -55°C; Max Operating Temperature: 155°C; Packaging: Tape and Reel; Tolerance: 1%; Resistor Type: Thick Film; Temperature Coefficient: 200ppm/°C; Radiation Hardening: No; RoHS Compliant: Yes; ComponentLink1URL: https://www.seielect.com/catalog/sei-rmcf_rmcp.pdf?src-supplier=Digi-Key; ComponentLink1Description: https://www.seielect.com/catalog/sei-rmcf_rmcp.pdf?src-supplier=Digi-Key; ComponentLink2URL: https://www.seielect.com/catalog/SEI-RMCF_RMCP.pdf?src-supplier=Avnet; ComponentLink2Description: https://www.seielect.com/catalog/SEI-RMCF_RMCP.pdf?src-supplier=Avnet
R39 = RC0603FR-073KL: Res 3000Ω ± 1.00% 0.1W ± 100ppm/℃ 0603; Manufacturer: Yageo; Resistance: 3kR; Power Rating: 100mW; Voltage Rating: 50V; Temperature Coefficient: 100ppm/°C; Supplier 1: Digi-Key; Manufacturer Part Number: RC0603FR-073KL; RoHS: Yes; Category: Chip SMD Resistors; Stock 1: 1079123; Pricing 1: 1=0.10000, 10=0.02400, 100=0.00970, 1000=0.00436, 2500=0.00378 (USD); Case/Package: 0603; Number of Pins: 2; Case Code (Imperial): 0603; Case Code (Metric): 1608; Size Code: 0603; Min Operating Temperature: -55°C; Max Operating Temperature: 155°C; Tolerance: 1%; Packaging: Tape and Reel; Termination: SMD/SMT; Resistor Type: Thick Film; Voltage Rating (DC): 50V; Features: Moisture Resistant; Series: RC; Max Power Dissipation: 100mW; Number of Terminations: 2; Construction: Rectangular; Resistance Tolerance: 1%; Length: 1.6mm; Width: 800um; Depth: 0.8mm; Military Standard: Not; Lead Free: Lead Free; RoHS Compliant: Yes; REACH SVHC: No SVHC; ComponentLink1URL: http://www.farnell.com/datasheets/2167052.pdf?src-supplier=Farnell; ComponentLink1Description: http://www.farnell.com/datasheets/2167052.pdf?src-supplier=Farnell; ComponentLink2URL: http://www.mouser.com/ds/2/447/RC0603-272842.pdf?src-supplier=Mouser; ComponentLink2Description: http://www.mouser.com/ds/2/447/RC0603-272842.pdf?src-supplier=Mouser; ComponentLink3URL: http://components.arrow.com/part/dataview/0323_00200942?src-supplier=Arrow+Europe; ComponentLink3Description: http://components.arrow.com/part/dataview/0323_00200942?src-supplier=Arrow+Europe; ComponentLink4URL: https://www.verical.com/server-webapp/html/getDatasheet?partID=135099&src-supplier=Verical; ComponentLink4Description: https://www.verical.com/server-webapp/html/getDatasheet?partID=135099&src-supplier=Verical; ComponentLink5URL: http://www.farnell.com/datasheets/2167052.pdf?src-supplier=Element14; ComponentLink5Description: http://www.farnell.com/datasheets/2167052.pdf?src-supplier=Element14; ComponentLink6URL: http://www.yageo.com/documents/recent/PYu-RC_Group_51_RoHS_L_10.pdf?src-supplier=Digi-Key; ComponentLink6Description: http://www.yageo.com/documents/recent/PYu-RC_Group_51_RoHS_L_10.pdf?src-supplier=Digi-Key; ComponentLink7URL: http://www.yageo.com/documents/recent/PYu-RC_Group_51_RoHS_L_9.pdf?src-supplier=Digi-Key; ComponentLink7Description: http://www.yageo.com/documents/recent/PYu-RC_Group_51_RoHS_L_9.pdf?src-supplier=Digi-Key; ComponentLink8URL: http://www.farnell.com/datasheets/1868787.pdf?src-supplier=Newark; ComponentLink8Description: http://www.farnell.com/datasheets/1868787.pdf?src-supplier=Newark; ComponentLink9URL: http://www.yageo.com/documents/recent/PYu-RC0603_51_RoHS_L_7.pdf?src-supplier=Future+Electronics; ComponentLink9Description: http://www.yageo.com/documents/recent/PYu-RC0603_51_RoHS_L_7.pdf?src-supplier=Future+Electronics
R40 = RMCF0603FT4M42: Res 4.42M Ohm 1% 1/10W ±200ppm/°C Molded SMD SMD Paper T/R; Manufacturer: Stackpole Electronics; Resistance: 4.42MR; Supplier 1: Digi-Key; Manufacturer Part Number: RMCF0603FT4M42; RoHS: Yes; Category: Chip SMD Resistors; Stock 1: 5226; Pricing 1: 1=0.10000, 10=0.02500, 100=0.01020, 1000=0.00457, 2500=0.00397 (USD); Mount: Surface Mount; Case/Package: 0603; Contact Plating: Tin,Matte; Min Operating Temperature: -55°C; Max Operating Temperature: 155°C; Packaging: Tape and Reel; Tolerance: 1%; Resistor Type: Thick Film; Temperature Coefficient: 200ppm/°C; Radiation Hardening: No; RoHS Compliant: Yes; ComponentLink1URL: https://www.seielect.com/catalog/SEI-RMCF_RMCP.pdf?src-supplier=Avnet; ComponentLink1Description: https://www.seielect.com/catalog/SEI-RMCF_RMCP.pdf?src-supplier=Avnet; ComponentLink2URL: https://www.seielect.com/catalog/sei-rmcf_rmcp.pdf?src-supplier=Digi-Key; ComponentLink2Description: https://www.seielect.com/catalog/sei-rmcf_rmcp.pdf?src-supplier=Digi-Key
U4 U6 = SP1003-01DTG: TVS DIODE 5VWM 12VC SOD723; Manufacturer: Littelfuse; Direction: Unidirectional; Reverse Breakdown Voltage: 6V; Operating Supply Voltage: 5V; Capacitance: 30pF; Max Surge Current: 7A; Number of Channels: 1; Clamping Voltage: 12V; Power Line Protection: No; Polarity: Bidirectional,Unidirectional; Test Current: 1mA; Leakage Current: 100nA; Diode Type: ZENER; Clamping Voltage-Max: 12.5V; Supplier 1: Digi-Key; Manufacturer Part Number: SP1003-01DTG; RoHS: Yes; Category: TVS Diodes; Stock 1: 163275; Pricing 1: 1=0.57000, 10=0.46200, 100=0.31430, 500=0.23576, 1000=0.17681, 2000=0.16208 (USD); Mount: Surface Mount; Number of Pins: 2; Min Operating Temperature: -40°C; Max Operating Temperature: 85°C; Packaging: Tape and Reel; Package Quantity: 8000; Number of Unidirectional Channels: 1; Reverse Standoff Voltage: 5V; Min Breakdown Voltage: 6V; Breakdown Voltage: 5V; Termination: SMD/SMT; Number of Elements: 1; Peak Pulse Current: 7A; Resistor Type: Zener; Series: SP1003, SPA®; REACH SVHC: No SVHC; Lead Free: Lead Free; RoHS Compliant: Yes; ComponentLink1URL: https://datasheet.ciiva.com/8062/littelfuse-spa-sp1003-series-8062432.pdf?src-supplier=Element14; ComponentLink1Description: https://datasheet.ciiva.com/8062/littelfuse-spa-sp1003-series-8062432.pdf?src-supplier=Element14; ComponentLink2URL: https://datasheet.ciiva.com/5771/littelfuse-spa-sp1003-series-5771141.pdf?src-supplier=Farnell; ComponentLink2Description: https://datasheet.ciiva.com/5771/littelfuse-spa-sp1003-series-5771141.pdf?src-supplier=Farnell; ComponentLink3URL: https://datasheet.ciiva.com/330/littelfuse-tvs-diode-array-sp1003-datasheet-pdf-330692.pdf?src-supplier=Digi-Key; ComponentLink3Description: https://datasheet.ciiva.com/330/littelfuse-tvs-diode-array-sp1003-datasheet-pdf-330692.pdf?src-supplier=Digi-Key; ComponentLink4URL: https://datasheet.ciiva.com/330/littelfuse-tvs-diode-array-sp1003-datasheet-pdf-330693.pdf?src-supplier=Digi-Key; ComponentLink4Description: https://datasheet.ciiva.com/330/littelfuse-tvs-diode-array-sp1003-datasheet-pdf-330693.pdf?src-supplier=Digi-Key; ComponentLink5URL: https://datasheet.ciiva.com/330/littelfuse-tvs-diode-array-sp1003-datasheet-pdf-330691.pdf?src-supplier=Digi-Key; ComponentLink5Description: https://datasheet.ciiva.com/330/littelfuse-tvs-diode-array-sp1003-datasheet-pdf-330691.pdf?src-supplier=Digi-Key; ComponentLink6URL: https://datasheet.ciiva.com/16216/littelfuse-spa-sp1003-series-16216345.pdf?src-supplier=Future+Electronics; ComponentLink6Description: https://datasheet.ciiva.com/16216/littelfuse-spa-sp1003-series-16216345.pdf?src-supplier=Future+Electronics
U7 = BQ25570RGRT: Switching Battery Charger Li-Ion/Li-Pol/Supercapacitor 110mA 2.2V to 5.5V 20-Pin VQFN EP T/R; Manufacturer: Texas Instruments; Output Current: 100mA; Operating Supply Current: 488nA; Min Supply Voltage: 100mV; Max Supply Voltage: 5.1V; Switching Frequency: 1MHz; Supplier 1: Digi-Key; Manufacturer Part Number: BQ25570RGRT; RoHS: Yes; Category: Battery Management; Stock 1: 22; Pricing 1: 1=8.95000, 10=8.08600, 25=7.71000, 100=6.69440 (USD); Mount: Surface Mount; Case/Package: VQFN; Number of Pins: 20; Contact Plating: Gold; Min Operating Temperature: -40°C; Max Operating Temperature: 125°C; Packaging: Tape and Reel; Package Quantity: 250; Radiation Hardening: No; REACH SVHC: No SVHC; Lead Free: Lead Free; RoHS Compliant: Yes; ComponentLink1URL: https://datasheet.ciiva.com/24110/slusbh2c-317150-24110945.pdf?src-supplier=Mouser; ComponentLink1Description: https://datasheet.ciiva.com/24110/slusbh2c-317150-24110945.pdf?src-supplier=Mouser; ComponentLink2URL: https://datasheet.ciiva.com/28483/1768287-28483478.pdf?src-supplier=Element14; ComponentLink2Description: https://datasheet.ciiva.com/28483/1768287-28483478.pdf?src-supplier=Element14; ComponentLink3URL: https://datasheet.ciiva.com/29590/bq25570-29590197.pdf?src-supplier=Digi-Key; ComponentLink3Description: https://datasheet.ciiva.com/29590/bq25570-29590197.pdf?src-supplier=Digi-Key; ComponentLink4URL: https://datasheet.ciiva.com/29590/bq25570-29590198.pdf?src-supplier=Digi-Key; ComponentLink4Description: https://datasheet.ciiva.com/29590/bq25570-29590198.pdf?src-supplier=Digi-Key; ComponentLink5URL: https://datasheet.ciiva.com/29892/bq25570-29892856.pdf?src-supplier=Avnet; ComponentLink5Description: https://datasheet.ciiva.com/29892/bq25570-29892856.pdf?src-supplier=Avnet; ComponentLink6URL: https://datasheet.ciiva.com/29892/bq25570-29892857.pdf?src-supplier=Avnet; ComponentLink6Description: https://datasheet.ciiva.com/29892/bq25570-29892857.pdf?src-supplier=Avnet